# EAGLE schematic I2C-LLC Mk 01 (EAGLE 7.6.0)
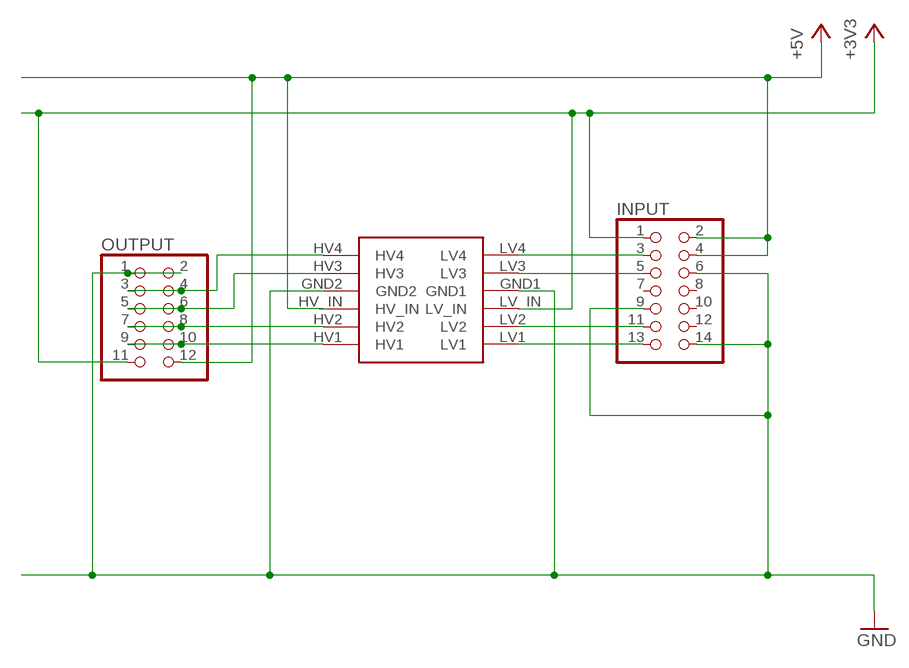
[diagram p0: schematic, sheet 1]

## Parts
INPUT  PINHD-2X7  [2X07]
OUTPUT  PINHD-2X6  [2X06]
U$1  BD-LLC  [BD-LLC]

## Nets
+3V3: INPUT.1 OUTPUT.11 U$1.LV_IN
+5V: INPUT.2 INPUT.4 OUTPUT.12 U$1.HV_IN
EX1_H: OUTPUT.7 OUTPUT.8 U$1.HV2
EX1_L: INPUT.11 U$1.LV2
EX2_H: OUTPUT.9 OUTPUT.10 U$1.HV1
EX2_L: INPUT.13 U$1.LV1
GND: INPUT.6 INPUT.9 INPUT.14 OUTPUT.1 OUTPUT.2 U$1.GND1 U$1.GND2
SCK_H: OUTPUT.5 OUTPUT.6 U$1.HV3
SCK_L: INPUT.5 U$1.LV3
SDA_H: OUTPUT.3 OUTPUT.4 U$1.HV4
SDA_L: INPUT.3 U$1.LV4
Unconnected: INPUT.7 INPUT.8 INPUT.10 INPUT.12

## Library data of the parts
INPUT = pinhead - big pad:PINHD-2X7: PIN HEADER
OUTPUT = pinhead - big pad:PINHD-2X6: PIN HEADER
U$1 = Sparkfun:BD-LLC